# Altium schematic sheet PWM.SchDoc
size A; Organization: Altium Limited; Address1: L3, 12a Rodborough Rd; Address2: Frenchs Forest; Address3: NSW; Address4: Australia 2086; DocumentNumber: 4; SheetNumber: 4; SheetTotal: 4
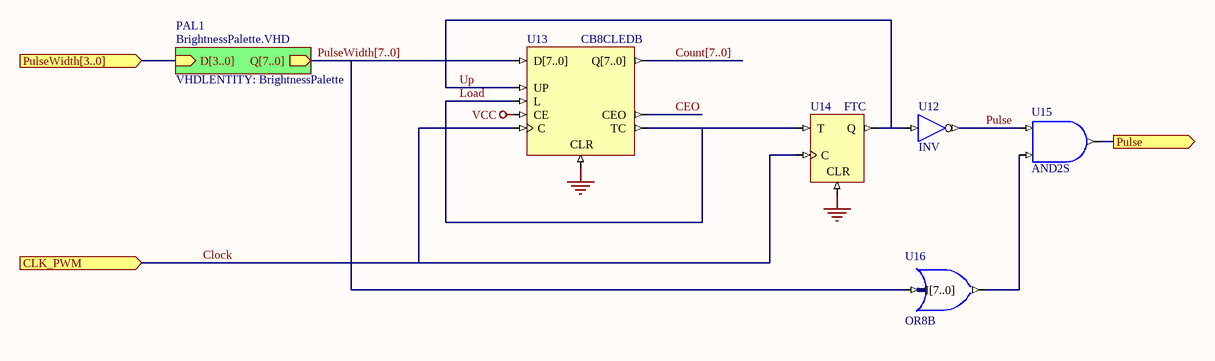
[diagram p0: PWM.SchDoc]

## Parts
U12  INV
U13  CB8CLEDB
U14  FTC
U15  AND2S
U16  OR8B

## Sub-sheets
PAL1 = BrightnessPalette.VHD: D[3..0] (in), Q[7..0] (out)  | VHDLENTITY: BrightnessPalette

## Ports
CLK_PWM (in), Pulse (out), PulseWidth[3..0] (in)

## Nets
GND: U13.CLR U14.CLR
VCC: U13.CE
CEO: U13.CEO
Clock: U13.C U14.C ; port CLK_PWM
Count[7..0]: U13.Q[7..0]
Load: U13.L U13.TC U14.T
Pulse: U12.O U15.I0
Pulse: U15.O ; port Pulse  [a separate net that carries the same name]
PulseWidth[7..0]: U13.D[7..0] U16.I[7..0] ; sheet PAL1/Q[7..0]
Up: U12.I U13.UP U14.Q
NetU15_I1: U15.I1 U16.O

## Buses and harness runs
bus Count[7..0]
bus port PulseWidth[3..0] = sheet PAL1/D[3..0]
bus PulseWidth[7..0] = sheet PAL1/Q[7..0]

## Notes on the sheet
- Title
- Size:
- Date:
- A
- Number:
- Time:
- Revision:
- Sheet
- of
- File:

## Library data of the parts
U12 = INV: Inverter; ArchiveName: GENERIC; VHDLIB_SIM: GENERIC_LIB; Published: 29-Jan-2004; Publisher: Altium Limited; Xilinx Equivalent: INV; Core Revision: 1.00.00
U13 = CB8CLEDB: 8-Bit Loadable Cascadable Bidirectional Binary Counter with Clock Enable and Asynchronous Clear, Bus Version; ArchiveName: GENERIC; VHDLIB_SIM: GENERIC_LIB; Published: 29-Jan-2004; Publisher: Altium Limited; Core Revision: 1.00.00; Xilinx Equivalent: CB8CLED
U14 = FTC: Toggle Flip-Flop with Toggle Enable and Asynchronous Clear; ArchiveName: GENERIC; VHDLIB_SIM: GENERIC_LIB; Published: 29-Jan-2004; Publisher: Altium Limited; Xilinx Equivalent: FTC; Core Revision: 1.00.00
U15 = AND2S: 2-Input AND Gate, Single Pin Version; Xilinx Equivalent: AND2; ArchiveName: GENERIC; VHDLIB_SIM: GENERIC_LIB; Published: 29-Jan-2004; Publisher: Altium Limited; Core Revision: 1.00.00
U16 = OR8B: 8-Input OR Gate, Bus Version; ArchiveName: GENERIC; VHDLIB_SIM: GENERIC_LIB; Published: 29-Jan-2004; Publisher: Altium Limited; Core Revision: 1.00.00